# Altium project Burn Wire Dev Board.PrjPcb
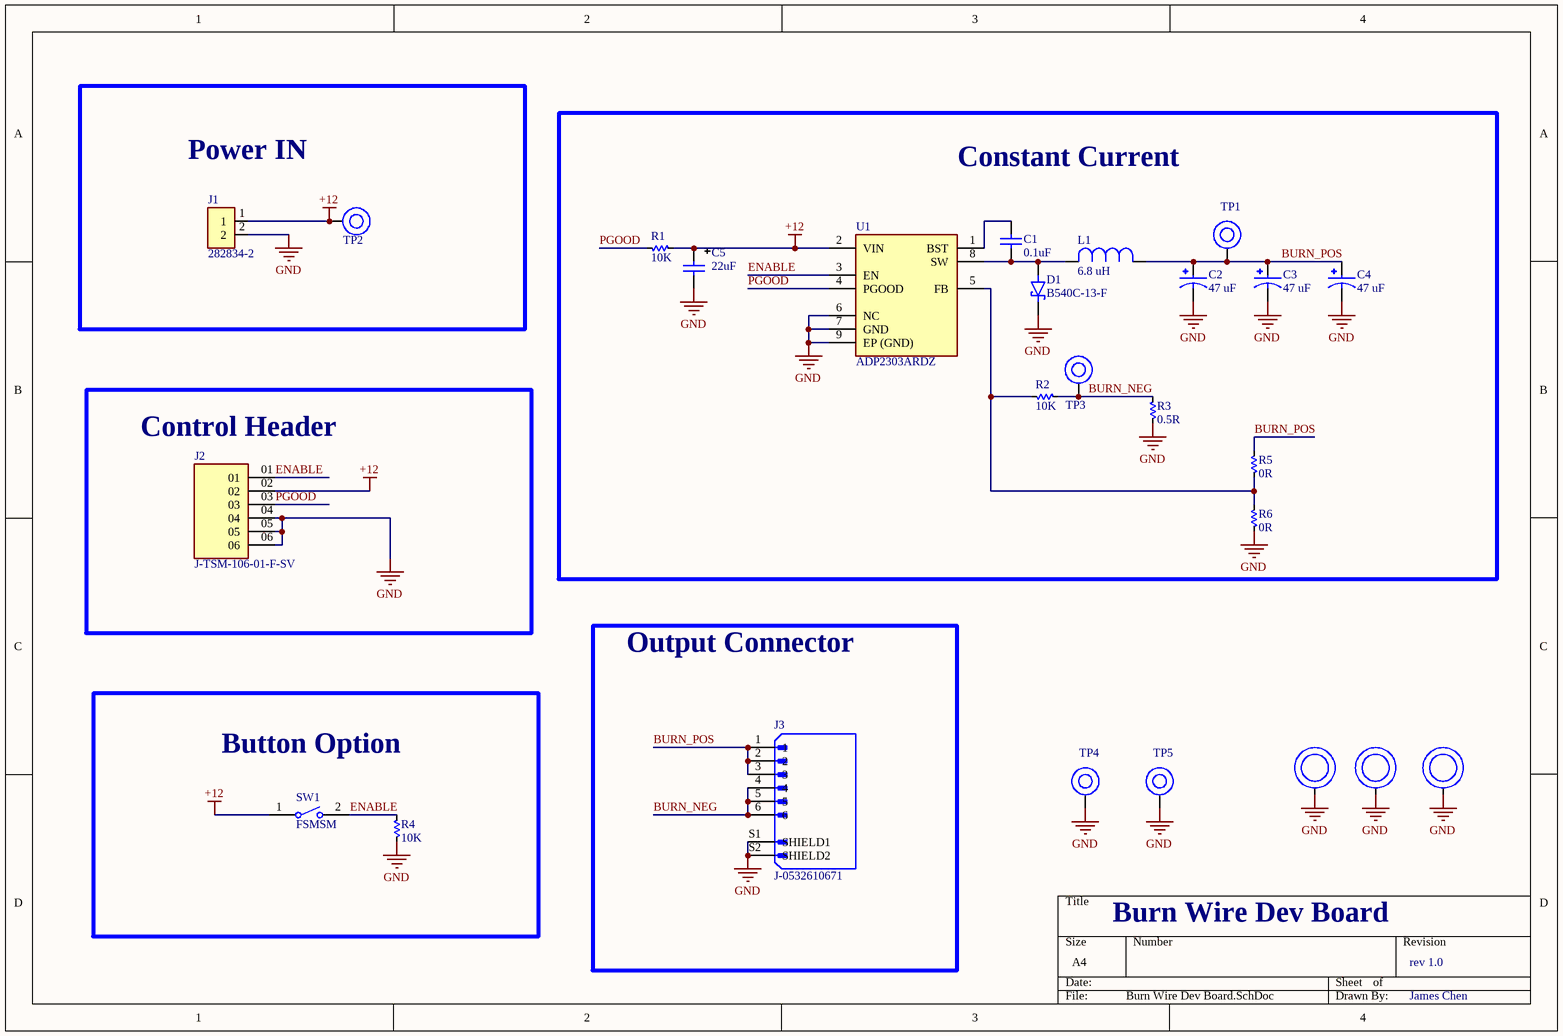
[diagram p0: Burn Wire Dev Board.SchDoc]
1 sheet, 26 parts. Net scope: global (net labels, ports and power ports of the same name join across sheets).
Board file: Burn Wire Dev Board.PcbDoc

## Sheet Burn Wire Dev Board.SchDoc
size A4; SheetNumber: 1; SheetTotal: 1

### Parts
*1  M2 Mounting  [M2 Screws]  (value not drawn)
*2  M2 Mounting  [M2 Screws]  (value not drawn)
*3  M2 Mounting  [M2 Screws]  (value not drawn)
C1  0.1uF  [0603]
C2  47 uF  [CC-25SVPF47M]
C3  47 uF  [CC-25SVPF47M]
C4  47 uF  [CC-25SVPF47M]
C5  22uF  [CAP TANT 1206 (A) TCJ]
D1  B540C-13-F  [D-B540C-13-F]
J1  282834-2  [J-282834-2]
J2  J-TSM-106-01-F-SV  [J-TSM-106-01-F-SV]
J3  J-0532610671  [J-0532610671]
L1  6.8 UH  [L-IHLP4040DZER6R8M01]
R1  10K  [0603]
R2  10K  [0603]
R3  0.5R  [2010]
R4  10K  [0603]
R5  0R  [0603]
R6  0R  [0603]
SW1  FSMSM  [TECO-FSMSM-2_V]
TP1  TP  [TP]  (value not drawn)
TP2  TP  [TP]  (value not drawn)
TP3  TP  [TP]  (value not drawn)
TP4  TP  [TP]  (value not drawn)
TP5  TP  [TP]  (value not drawn)
U1  ADP2303ARDZ  [U-ADP2303ARDZ]

### Blocks framed on the sheet
Power IN: J1 TP2
Constant Current: C1-C5 D1 L1 R1-R3 R5 R6 TP1 TP3 U1
Control Header: J2
Output Connector: J3
Button Option: R4 SW1

### Nets
+12: C5.1 J1.1 J2.02 R1.2 SW1.1 TP2.1 U1.2(VIN)
GND: *1.1 *2.1 *3.1 C2.2 C3.2 C4.2 C5.2 D1.C(K) J1.2 J2.04 J2.05 J2.06 J3.S1(SHIELD1) J3.S2(SHIELD2) R3.1 R4.1 R6.1 TP4.1 TP5.1 U1.6(NC) U1.7(GND) U1.9(EP_(GND))
BURN_NEG: J3.4 J3.5 J3.6 R2.2 R3.2 TP3.1
BURN_POS: C2.1 C3.1 C4.1 J3.1 J3.2 J3.3 L1.1 R5.2 TP1.1
ENABLE: J2.01 R4.2 SW1.2 U1.3(EN)
PGOOD: J2.03 R1.1 U1.4(PGOOD)
NetC1_1: C1.1 D1.A L1.2 U1.8(SW)
NetC1_2: C1.2 U1.1(BST)
NetR2_1: R2.1 R5.1 R6.2 U1.5(FB)

### Notes on the sheet
- Burn Wire Dev Board
- rev 1.0
- James Chen

### Library data of the parts
C1 = CC-104-K-25V-X7R-0603: 0.1 µF ±10% 25V Ceramic Capacitor X7R 0603 (1608 Metric); Manufacturer: Samsung Electro-Mechanics; Manufacturer Part #: CL10B104KA8NNNC; ComponentLink1description: Datasheet; ComponentLink1URL: https://ds.yuden.co.jp/TYCOMPAS/ut/detail?pn=TMK105BJ104KV-F%20%20&u=M; ComponentLink2description: Manufacturer Website; Distributor: Digikey; Distributor Part #: 1276-1006-1-ND; Part Description: 0.1 µF ±10% 25V Ceramic Capacitor X7R 0603 (1608 Metric); ComponentLink2URL: https://www.yuden.co.jp/or/; Value: 0.1uF
C2-C4 = CC-25SVPF47M: CAP ALUM POLY 47UF 20% 25V SMD; Manufacturer: Panasonic Electronic Components; ComponentLink1Description: Datasheet; ComponentLink1URL: *; ComponentLink2Description: Manufacture Website; ComponentLink2URL: *; Distributor: Digikey; Distributor Part #: P16513CT-ND; Manufacturer Part #: 25SVPF47M; Part Description: CAP ALUM POLY 47UF 20% 25V SMD; Value: 47 uF
C5 = CT-225-M-20V-OTH-1206: CAP TANT 22UF 10% 10V 1206; Manufacturer: KYOCERA AVX; Manufacturer Part #: TPSA226K010T0900; ComponentLink1Description: Datasheet; ComponentLink1URL: *; ComponentLink2Description: Manufacturer Website; ComponentLink2URL: *; Distributor: Digikey; Distributor Part #: 478-11193-1-ND; Part Description: CAP TANT 22UF 10% 10V 1206; Value: 22uF
D1 = D-B540C-13-F: DIODE SCHOTTKY 40V 5A SMC; Manufacturer: Diodes Incorporated; Manufacturer Part #: B540C-13-F; Distributor Part #: B540C-FDICT-ND; Distributor: Digikey
J1 = J-282834-2: TERM BLK 2P SIDE ENT 2.54MM PCB; Manufacturer: TE Connectivity AMP Connectors; Manufacturer Part #: 282834-2; Distributor Part #: A98333-ND; Distributor: Digikey
J2 = J-TSM-106-01-F-SV: CONN HEADER SMD 6POS 2.54MM; Manufacturer: Samtec Inc.; Distrbutor Part #: SAM12239-ND; Distributor: Digikey; Manufacturer Part #: TSM-106-01-F-SV
J3 = J-0532610671: CONN HEADER SMD R/A 6POS 1.25MM; Manfacturer: Molex; Distributor: Digi-Key; Manfacturer Part #: 0532610671; Distributor Part #: WM7624CT-ND
L1 = L-IHLP4040DZER6R8M01: FIXED IND 6.8UH 8A 23.3 MOHM SMD; Manufacturer: Vishay Dale; Manufacturer Part #: IHLP4040DZER6R8M01; Distributor Part #: 541-1303-1-ND; Distributor: Digikey; Value: 6.8 uH
R1 R2 R4 = RT-10K0-F-1/16W-0603: RES 10K OHM 1% 1/8W 0603; Manufacturer: Stackpole Electronics Inc; Manufacturer Part #: RNCP0603FTD10K0; ComponentLink1description: Datasheet; ComponentLink1URL: https://www.vishay.com/docs/20035/dcrcwe3.pdf; ComponentLink2description: Manufacturer Website; Distributor: Digikey; Distributor Part #: RNCP0603FTD10K0CT-ND; Part Description: RES 10K OHM 1% 1/8W 0603; ComponentLink2URL: https://www.vishay.com/; Value: 10K
R3 = RT-0.5R0-F-1W-2010: RES 0.5 OHM 1% 1W 2010; Manufacturer: Vishay Dale; Manufacturer Part #: WSLT2010R5000FEA18; ComponentLink1description: Datasheet; ComponentLink1URL: https://www.vishay.com/docs/20035/dcrcwe3.pdf; ComponentLink2description: Manufacturer Website; Distributor: Digikey; Distributor Part #: 541-10112-1-ND; Part Description: RES 0.5 OHM 1% 1W 2010; ComponentLink2URL: https://www.vishay.com/; Value: 0.5R
R5 R6 = RT-0R00-F-1/10W-0603: 0 Ohms Jumper 0.1W, 1/10W Chip Resistor 0603 (1608 Metric) Automotive AEC-Q200 Thick Film; Manufacturer: Stackpole Electronics Inc; Manufacturer Part #: RMCF0603ZT0R00; ComponentLink1description: Datasheet; ComponentLink1URL: https://industrial.panasonic.com/ww/products/resistors/chip-resistors/general-purpose-chip-resistors/models/ERJ2GE0R00X; ComponentLink2description: Manufacturer Website; Distributor: Digikey; Distributor Part #: RMCF0603ZT0R00CT-ND; Part Description: 0 Ohms Jumper 0.1W, 1/10W Chip Resistor 0603 (1608 Metric) Automotive AEC-Q200 Thick Film; ComponentLink2URL: https://industrial.panasonic.com/ww/products/resistors/chip-resistors/general-purpose-chip-resistors/models/ERJ2GE0R00X; Value: 0R
SW1 = CMP-2000-07511-1: FSMSM Push Button Switch, 50 mA, -35 to 85 degC, 2-Pin SMD, RoHS, Bulk; Manufacturer: TE Connectivity; Actuator Length: 1.07mm; Electrical Life: 20000Cycles; Actuator Material: Polyamide; Current Rating: 50mA; Illumination Type: Illuminated; Voltage Rating (DC): 24V; Contact Resistance: 100mOhm; Case\/Package: SMD/SMT; Operating Force: 180gf; Switch Travel: 0.25mm; Max Voltage Rating (DC): 12V; Throw Configuration: SPST; Packaging: LoosePiece; Max Operating Temperature: 85degC; ELV: Compliant; Package Description: 2-Pin Surface Mount Device, Body 6 x 3.5 mm, Pitch 9.19 mm; RoHSCompliant: true; Manufacturer URL: http://www.te.com/; Contact Plating: Silver; Contact Material: Brass; Mounting Technology: SurfaceMount; Contact Current Rating: 50mA; Datasheet Version: Rev. C2, 08/2014; Datasheet URL: http://www.te.com/commerce/DocumentDelivery/DDEController?Action=showdoc&DocId=Customer+Drawing%7F1437566-3%7FC2%7Fpdf%7FEnglish%7FENG_CD_1437566-3_C2_1437566_3_1_c.dwg.pdf%7F1437566-3; Mechanical Life: 20000Cycles; Package Reference: FSMSM; REACH SVHC: Unknown; Orientation: Straight; Min Operating Temperature: -35degC; Lead Free: LeadFree; Termination: GullWing; Package Quantity: 1000; Mount: SurfaceMount
TP1-TP5 = TP: Test Point; ComponentLink1description: Datasheet; ComponentLink1URL: https://industrial.panasonic.com/ww/products/resistors/chip-resistors/general-purpose-chip-resistors/models/ERJ2GE0R00X; ComponentLink2description: Manufacturer Website; ComponentLink2URL: https://industrial.panasonic.com/ww/products/resistors/chip-resistors/general-purpose-chip-resistors/models/ERJ2GE0R00X
U1 = U-ADP2303ARDZ: IC REG BUCK ADJUSTABLE 3A 8SOIC; Manufacturer: Analog Devices Inc.; Manufacturer Part #: ADP2303ARDZ; Distributor: Digikey; Distributor Part #: 505-ADP2303ARDZ-ND

## Assembly variants
Build: not fitted C41 R3 R5 R6 R7 R12 R19 R20 R22 R26 R40 R78 R91 R92 R109 R139 R149 R? R?